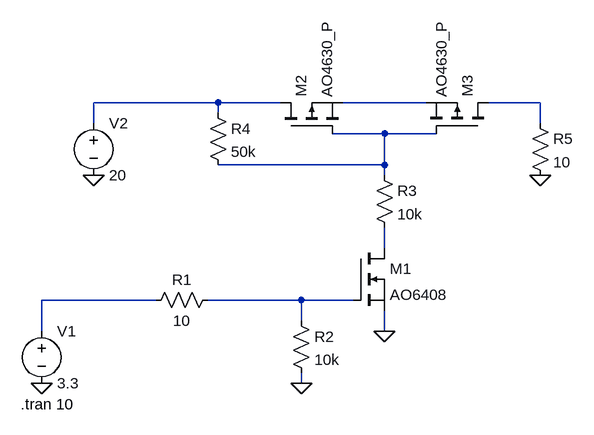
[diagram p0: schematic LoadSwtch.asc]
LoadSwtch.asc, the LTspice schematic file:
Version 4
SHEET 1 880 680
WIRE -16 -112 -208 -112
WIRE 80 -112 -16 -112
WIRE 304 -112 176 -112
WIRE 480 -112 400 -112
WIRE -16 -96 -16 -112
WIRE -208 -80 -208 -112
WIRE 480 -80 480 -112
WIRE 240 -64 160 -64
WIRE 320 -64 240 -64
WIRE 240 -16 240 -64
WIRE 240 -16 -16 -16
WIRE 240 0 240 -16
WIRE 240 112 240 80
WIRE -112 192 -288 192
WIRE 112 192 -32 192
WIRE 192 192 112 192
WIRE 112 224 112 192
WIRE -288 240 -288 192
WIRE 240 240 240 208
WIRE 112 320 112 304
FLAG 240 240 0
FLAG 112 320 0
FLAG -288 320 0
FLAG -208 0 0
FLAG 480 0 0
SYMBOL nmos 192 112 R0
SYMATTR InstName M1
SYMATTR Value AO6408
SYMBOL res -16 176 R90
WINDOW 0 0 56 VBottom 2
WINDOW 3 32 56 VTop 2
SYMATTR InstName R1
SYMATTR Value 10
SYMBOL res 96 208 R0
SYMATTR InstName R2
SYMATTR Value 10k
SYMBOL voltage -288 224 R0
WINDOW 123 0 0 Left 0
WINDOW 39 0 0 Left 0
SYMATTR InstName V1
SYMATTR Value 3.3
SYMBOL res 224 -16 R0
SYMATTR InstName R3
SYMATTR Value 10k
SYMBOL pmos 80 -64 R270
SYMATTR InstName M2
SYMATTR Value AO4630_P
SYMBOL pmos 400 -64 M270
SYMATTR InstName M3
SYMATTR Value AO4630_P
SYMBOL res -32 -112 R0
SYMATTR InstName R4
SYMATTR Value 50k
SYMBOL voltage -208 -96 R0
WINDOW 123 0 0 Left 0
WINDOW 39 0 0 Left 0
SYMATTR InstName V2
SYMATTR Value 20
SYMBOL res 464 -96 R0
SYMATTR InstName R5
SYMATTR Value 10
TEXT -320 352 Left 2 !.tran 10

The netlist it stands for:
* LoadSwtch.asc
M1 N005 N007 0 0 AO6408
R1 N007 N006 10
R2 N007 0 10k
V1 N006 0 3.3
R3 N004 N005 10k
M2 N001 N004 N002 N002 AO4630_P
M3 N003 N004 N002 N002 AO4630_P
R4 N001 N004 50k
V2 N001 0 20
R5 N003 0 10
.model NMOS NMOS
.model PMOS PMOS
.lib standard.mos
.tran 10
.backanno
.end